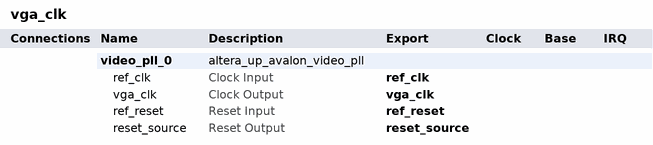
[diagram p0: system contents]
# Platform Designer (Qsys) system vga_clk, Cyclone V 5CSEMA5F31C6
# Parameters at their usual value, and those the tool derives, are not listed.
package require -exact qsys 18.0
create_system vga_clk
set_project_property DEVICE_FAMILY {Cyclone V}
set_project_property DEVICE 5CSEMA5F31C6

add_instance video_pll_0 altera_up_avalon_video_pll 18.0
set_instance_property video_pll_0 AUTO_EXPORT true
set_instance_parameter_value video_pll_0 camera {5MP Digital Camera (THDB_D5M)}
set_instance_parameter_value video_pll_0 gui_refclk 50.0
set_instance_parameter_value video_pll_0 lcd {7" LCD on VEEK-MT and MTL/MTL2 Modules}

# exported interfaces
add_interface ref_clk clock sink
set_interface_property ref_clk EXPORT_OF video_pll_0.ref_clk
add_interface ref_reset reset sink
set_interface_property ref_reset EXPORT_OF video_pll_0.ref_reset
add_interface reset_source reset source
set_interface_property reset_source EXPORT_OF video_pll_0.reset_source
add_interface vga_clk clock source
set_interface_property vga_clk EXPORT_OF video_pll_0.vga_clk

set_interconnect_requirement {$system} qsys_mm.clockCrossingAdapter HANDSHAKE
set_interconnect_requirement {$system} qsys_mm.enableEccProtection FALSE
set_interconnect_requirement {$system} qsys_mm.insertDefaultSlave FALSE
set_interconnect_requirement {$system} qsys_mm.maxAdditionalLatency 1

save_system vga_clk.qsys
